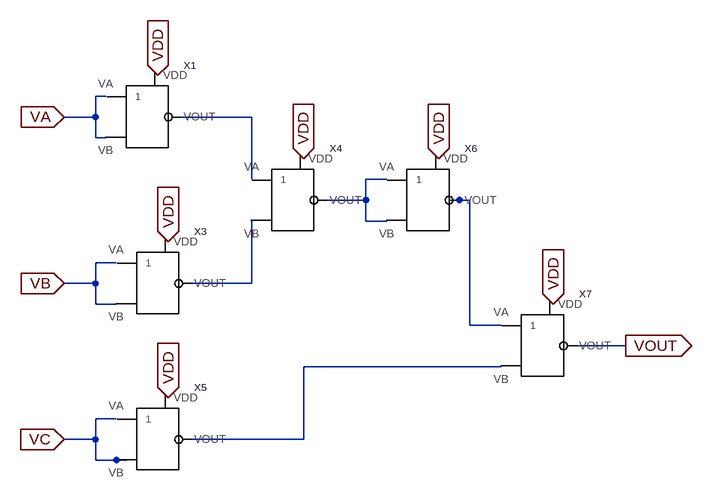
[diagram p0: schematic DraftFinal.asc]
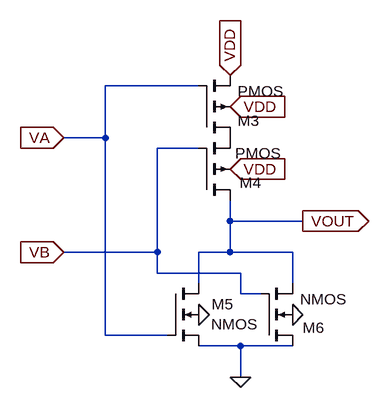
[diagram p1: sub-circuit nor.asc]
DraftFinal.asc, the LTspice schematic file:
Version 4
SHEET 1 1372 1632
WIRE 176 544 160 544
WIRE 160 576 160 544
WIRE 160 576 112 576
WIRE 400 576 288 576
WIRE 160 608 160 576
WIRE 176 608 160 608
WIRE 400 672 400 576
WIRE 608 672 576 672
WIRE 576 704 576 672
WIRE 576 704 512 704
WIRE 720 704 704 704
WIRE 736 704 720 704
WIRE 576 736 576 704
WIRE 608 736 576 736
WIRE 192 800 160 800
WIRE 160 832 160 800
WIRE 160 832 112 832
WIRE 400 832 400 736
WIRE 400 832 304 832
WIRE 160 864 160 832
WIRE 192 864 160 864
WIRE 736 896 736 704
WIRE 784 896 736 896
WIRE 976 928 896 928
WIRE 784 960 480 960
WIRE 192 1040 160 1040
WIRE 160 1072 160 1040
WIRE 160 1072 112 1072
WIRE 480 1072 480 960
WIRE 480 1072 304 1072
WIRE 160 1104 160 1072
WIRE 192 1104 160 1104
WIRE 208 1104 192 1104
FLAG 112 576 VA
IOPIN 112 576 In
FLAG 112 832 VB
IOPIN 112 832 In
FLAG 112 1072 VC
IOPIN 112 1072 In
FLAG 256 512 VDD
IOPIN 256 512 In
FLAG 480 640 VDD
IOPIN 480 640 In
FLAG 688 640 VDD
IOPIN 688 640 In
FLAG 272 768 VDD
IOPIN 272 768 In
FLAG 272 1008 VDD
IOPIN 272 1008 In
FLAG 864 864 VDD
IOPIN 864 864 In
FLAG 976 928 VOUT
IOPIN 976 928 Out
SYMBOL nor 256 832 R0
SYMATTR InstName X3
SYMBOL nor 464 704 R0
SYMATTR InstName X4
SYMBOL nor 256 1072 R0
SYMATTR InstName X5
SYMBOL nor 848 928 R0
SYMATTR InstName X7
SYMBOL nor 672 704 R0
SYMATTR InstName X6
SYMBOL nor 240 576 R0
SYMATTR InstName X1

nor.asc, the sub-circuit schematic file:
Version 4
SHEET 1 880 680
WIRE -656 -16 -800 -16
WIRE -800 64 -800 -16
WIRE -800 64 -864 64
WIRE -656 80 -720 80
WIRE -608 192 -608 160
WIRE -496 192 -608 192
WIRE -720 240 -720 80
WIRE -720 240 -864 240
WIRE -608 240 -608 192
WIRE -608 240 -656 240
WIRE -512 240 -608 240
WIRE -720 272 -720 240
WIRE -592 272 -720 272
WIRE -656 288 -656 240
WIRE -512 288 -512 240
WIRE -592 304 -592 272
WIRE -560 304 -592 304
WIRE -800 368 -800 64
WIRE -704 368 -800 368
WIRE -592 384 -656 384
WIRE -512 384 -592 384
WIRE -592 432 -592 384
FLAG -592 432 0
FLAG -608 -32 VDD
IOPIN -608 -32 In
FLAG -656 336 0
FLAG -512 336 0
FLAG -864 64 VA
IOPIN -864 64 In
FLAG -864 240 VB
IOPIN -864 240 In
FLAG -496 192 VOUT
IOPIN -496 192 Out
FLAG -608 16 VDD
IOPIN -608 16 In
FLAG -608 112 VDD
IOPIN -608 112 In
SYMBOL pmos4 -656 64 M180
WINDOW 0 60 26 Left 2
WINDOW 3 60 72 Left 2
SYMATTR InstName M3
SYMBOL pmos4 -656 160 M180
WINDOW 0 63 27 Left 2
SYMATTR InstName M4
SYMBOL nmos4 -704 288 R0
WINDOW 0 68 32 Left 2
WINDOW 3 67 63 Left 2
SYMATTR InstName M5
SYMBOL nmos4 -560 384 M180
WINDOW 0 64 28 Left 2
WINDOW 3 60 72 Left 2
SYMATTR InstName M6

The netlist it stands for:
* DraftFinal.asc
XX3 VB VB VDD N004 nor
XX4 N001 N004 VDD N002 nor
XX5 VC VC VDD N005 nor
XX7 N003 N005 VDD VOUT nor
XX6 N002 N002 VDD N003 nor
XX1 VA VA VDD N001 nor

* block symbol definitions
.subckt nor VA VB VDD VOUT
M3 P001 VA VDD VDD PMOS
M4 VOUT VB P001 VDD PMOS
M5 VOUT VA 0 0 NMOS
M6 0 VB VOUT 0 NMOS
.ends nor

.model NMOS NMOS
.model PMOS PMOS
.lib standard.mos
.backanno
.end